# Altium schematic sheet Power_Supply Voltage.SchDoc
size A4
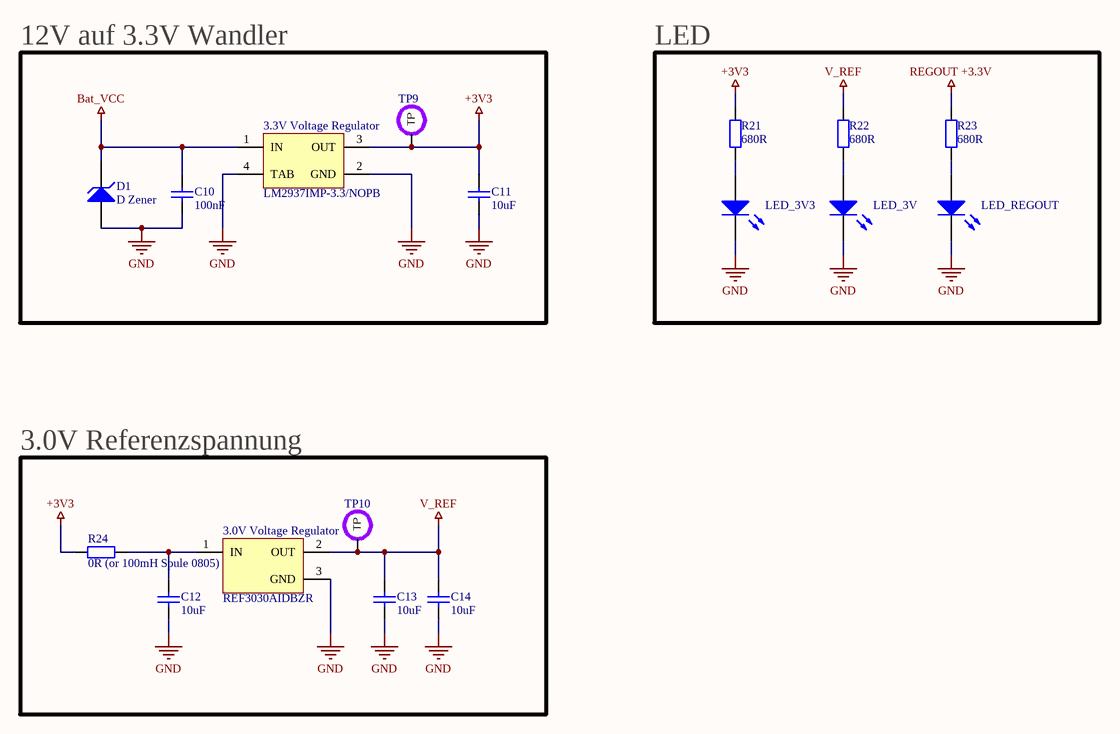
[diagram p0: Power_Supply Voltage.SchDoc]

## Parts
3.0V_Voltage_Regulator  REF3030AIDBZR  [DBZ0003A_L]
3.3V_Voltage_Regulator  LM2937IMP-3.3/NOPB  [DCY0004A_M]
C10  100nF  [C1206]
C11  10uF  [1608[0603]]
C12  10uF  [1608[0603]]
C13  10uF  [1608[0603]]
C14  10uF  [1608[0603]]
D1  D Zener  [SMB]
LED_3V  LED_3V  [1608[0603]]  (value not drawn)
LED_3V3  LED_3V3  [1608[0603]]  (value not drawn)
LED_REGOUT  LED_3V  [1608[0603]]  (value not drawn)
R21  680R  [J1-0603]
R22  680R  [J1-0603]
R23  680R  [J1-0603]
R24  0R (or 100mH Spule 0805)  [J1-0603]
TP9  TP_1  [Test point]  (value not drawn)  (no BOM)
TP10  TP_1  [Test point]  (value not drawn)  (no BOM)

## Blocks framed on the sheet
12V auf 3.3V Wandler: 3.3V_Voltage_Regulator C10 C11 D1 TP9
LED: LED_3V LED_3V3 LED_REGOUT R21-R23
3.0V Referenzspannung: 3.0V_Voltage_Regulator C12-C14 R24 TP10

## Nets
+3V3: 3.3V_Voltage_Regulator.3(OUT) C11.2 R21.1 R24.2 TP9.1(TP)
Bat_VCC: 3.3V_Voltage_Regulator.1(IN) C10.2 D1.2(K)
GND: 3.0V_Voltage_Regulator.3(GND) 3.3V_Voltage_Regulator.2(GND) 3.3V_Voltage_Regulator.4(TAB) C10.1 C11.1 C12.1 C13.1 C14.1 D1.1(A) LED_3V.2(K) LED_3V3.2(K) LED_REGOUT.2(K)
REGOUT +3.3V: R23.1
V_REF: 3.0V_Voltage_Regulator.2(OUT) C13.2 C14.2 R22.1 TP10.1(TP)
Net3.0V_Voltage_Regulator_1: 3.0V_Voltage_Regulator.1(IN) C12.2 R24.1
NetLED_3V3_1: LED_3V3.1(A) R21.2
NetLED_3V_1: LED_3V.1(A) R22.2
NetLED_REGOUT_1: LED_REGOUT.1(A) R23.2

## Library data of the parts
3.0V_Voltage_Regulator = CMP-0367-00154-2: 3.0 V, 50 ppm / degC, 50 uA Series (Bandgap) Voltage Reference, -40 to 125 degC, 3-pin SOT-23 (DBZ), Green (RoHS & no Sb/Br); Manufacturer: Texas Instruments; SubFamily: Series Voltage Reference; Temp Coeff(Typ)(ppm/ degree C): 20; Temp Coeff(Max)(ppm/ degree C): 50; Rating: Catalog; ComponentLink2URL: http://www.ti.com/general/docs/lit/getliterature.tsp?genericPartNumber=REF3030&fileType=pdf; DatasheetVersion: SBVS032F; PackageReference: DBZ0003A; PackageDescription: 3-Pin Plastic Small Outline, Body 2.92 x 1.3 mm, Pitch 0.95 mm; ComponentLink1URL: http://www.ti.com/; ComponentLink3Description: Package Specification; PackageVersion: 4203227/B; PartNumber: REF3030AIDBZR; Mounting Technology: Surface Mount; ComponentLink2Description: Datasheet; ComponentLink3URL: http://www.ti.com/litv/pdf/mpds108a; ComponentLink1Description: Manufacturer URL; Code_JEDEC: TO-236; Eco-Plan: Green (RoHS & no Sb/Br)
3.3V_Voltage_Regulator = CMP-0062-01754-3: 400mA and 500mA Voltage Regulator, 4-pin SOT-223, Pb-Free; Manufacturer: Texas Instruments; CompType: LDO IC; PowerWise: N; PackageTopMarking: XYTT*L69B; PackageReference: DCY0004A; PackageDescription: Molded SOT-223, 6.50 x 3.56 x 1.6mm Body, 4 Lead, 2.3mm Pitch; ComponentLink1Description: Datasheet URL; Code_IPC: SOT223-4; ComponentLink1URL: http://www.ti.com/general/docs/lit/getliterature.tsp?genericPartNumber=LM2937-3.3&fileType=pdf; RoHS: Y; PinCount: 4; Code_JEDEC: TO-261-AA
C10-C14 = Cap: Capacitor; Value: 220nF; Published: 8-Jun-2000; LatestRevisionDate: 17-Jul-2002; LatestRevisionNote: Re-released for DXP Platform.; PackageReference: RAD-0.3; Publisher: Altium Limited; PackageDescription: Radial Cap, Thru-Hole; 2 Leads; 0.3 in Pin Spacing
D1 = D Zener: Zener Diode; Published: 8-Jun-2000; LatestRevisionDate: 17-Jul-2002; LatestRevisionNote: Re-released for DXP Platform.; PackageReference: DIODE-0.7; Publisher: Altium Limited; PackageDescription: Diode, Thru-Hole; 2 Leads; 0.7 in Pin Spacing
LED_3V LED_3V3 LED_REGOUT = LED0: Typical INFRARED GaAs LED; Published: 8-Jun-2000; LatestRevisionDate: 08-Jul-2005; LatestRevisionNote: Mech Layer 1 removed.; PackageReference: LED-0; Publisher: Altium Limited; PackageDescription: LED; 2 Leads
R21-R24 = Res2: Resistor; Value: 10kR; Published: 8-Jun-2000; LatestRevisionDate: 17-Jul-2002; LatestRevisionNote: Re-released for DXP Platform.; PackageReference: AXIAL-0.4; Publisher: Altium Limited; PackageDescription: Axial Device, Thru-Hole; 2 Leads; 0.4 in Pin Spacing
TP9 TP10 = Test point